# Altium project ElectronicsBox_v3.PrjPcb
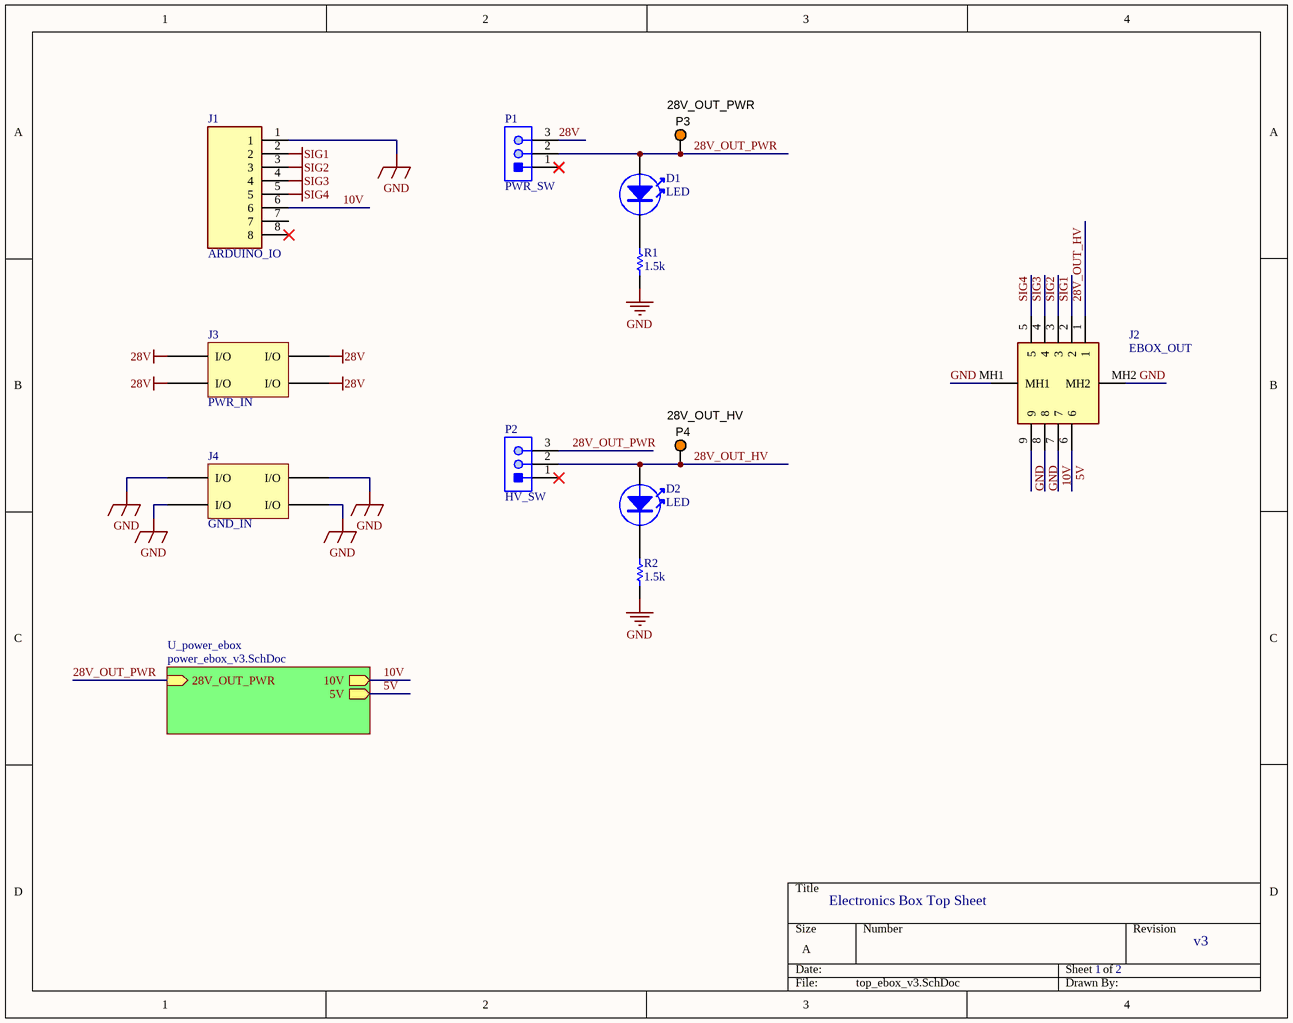
[diagram p0: top_ebox_v3.SchDoc]
2 sheets, 28 parts. Net scope: hierarchical (ports join the sheet entries above them; power ports are global).
Board file: ebox_board_v3.PcbDoc
Sheets:
  top_ebox_v3.SchDoc
    U_power_ebox = power_ebox_v3.SchDoc

## Sheet top_ebox_v3.SchDoc
size A; SheetNumber: 1; SheetTotal: 2

### Parts
D1  LED  [LED 12V Thru Hole]
D2  LED  [LED 12V Thru Hole]
J1  ARDUINO_IO  [1x8 Molex Header - Female]
J2  EBOX_OUT  [9-Pin D-Sub]
J3  PWR_IN  [Banana Jack]
J4  GND_IN  [Banana Jack]
P1  PWR_SW  [3x1 KK Molex]
P2  HV_SW  [3x1 KK Molex]
P3  28V_OUT_PWR  [KSTN-5003]
P4  28V_OUT_HV  [KSTN-5003]
R1  1.5k  [General Resistor]
R2  1.5k  [General Resistor]

### Sub-sheets
U_power_ebox = power_ebox_v3.SchDoc: 10V (out), 5V (out), 28V_OUT_PWR (in)

### Nets
28V: J3.1(I/O) J3.2(I/O) J3.3(I/O) J3.4(I/O) P1.3
GND: J1.1 J2.8 J2.9 J2.MH1 J2.MH2 J4.1(I/O) J4.2(I/O) J4.3(I/O) J4.4(I/O) R1.2 R2.2
SIG1: J1.2 J2.2
SIG2: J1.3 J2.3
SIG3: J1.4 J2.4
SIG4: J1.5 J2.5
5V: J2.6 ; sheet U_power_ebox/5V
10V: J1.6 J2.7 ; sheet U_power_ebox/10V
28V_OUT_HV: D2.1 J2.1 P2.2 P4.1
28V_OUT_PWR: D1.1 P1.2 P2.3 P3.1 ; sheet U_power_ebox/28V_OUT_PWR
NetD1_2: D1.2 R1.1
NetD2_2: D2.2 R2.1

Not connected (* = marked no-connect by the designer): J1 7 8*; P1 1*; P2 1*

### Notes on the sheet
- Electronics Box Top Sheet
- 1
- 2
- v3

### Library data of the parts
J1 = 207843-0008: KK Molex 1x8 Header; Datasheet Link: https://www.molex.com/pdm_docs/sd/2078430008_sd.pdf; Height: 6.95mm; Manufacturer_Name: Molex; Manufacturer_Part_Number: 207843-0008; Mouser Part Number: 538-207843-0008; Mouser Price/Stock: https://www.mouser.co.uk/ProductDetail/Molex/207843-0008?qs=XeJtXLiO41QJV3n1oae5pg%3D%3D
J2 = 2311765-1: Connector; Manufacturer_Name: TE Connectivity; Datasheet Link: https://componentsearchengine.com//2311765-1.pdf; Height: 12.8mm; Mouser2 Part Number: 571-2311765-1; Mouser2 Price/Stock: https://www.mouser.com/Search/Refine.aspx?Keyword=571-2311765-1; Manufacturer_Part_Number: 2311765-1
J3 J4 = Banana Jack: Female
P1 P2 = KK 254 1x3 male header: 22112032
P3 P4 = CMP-002-00037-2: Test Point, Orange, Height 4.6 mm, Tail Length 3 mm, 1-Pin THD, RoHS; Manufacturer: Keystone; Colour: Orange; Packaging: Bulk; Package Description: 1-Pin Through Hole Device, Dia 2.54 mm; Pins: 1; Package Reference: 5003; Datasheet Version: Jun-15; Case/Package: 5003; Mounting Technology: TH; Connector Type: TestPoint; Diameter: 2.54mm; Contact Material: Bronze; Datasheet URL: http://keyelco.com/userAssets/file/M65p56.pdf; Manufacturer URL: http://www.keyelco.com/; Package Quantity: 10; Contact Plating: Tin; RoHS Compliant: True
R1 R2 = Resistor

## Sheet power_ebox_v3.SchDoc
size A; SheetNumber: 2; SheetTotal: 2
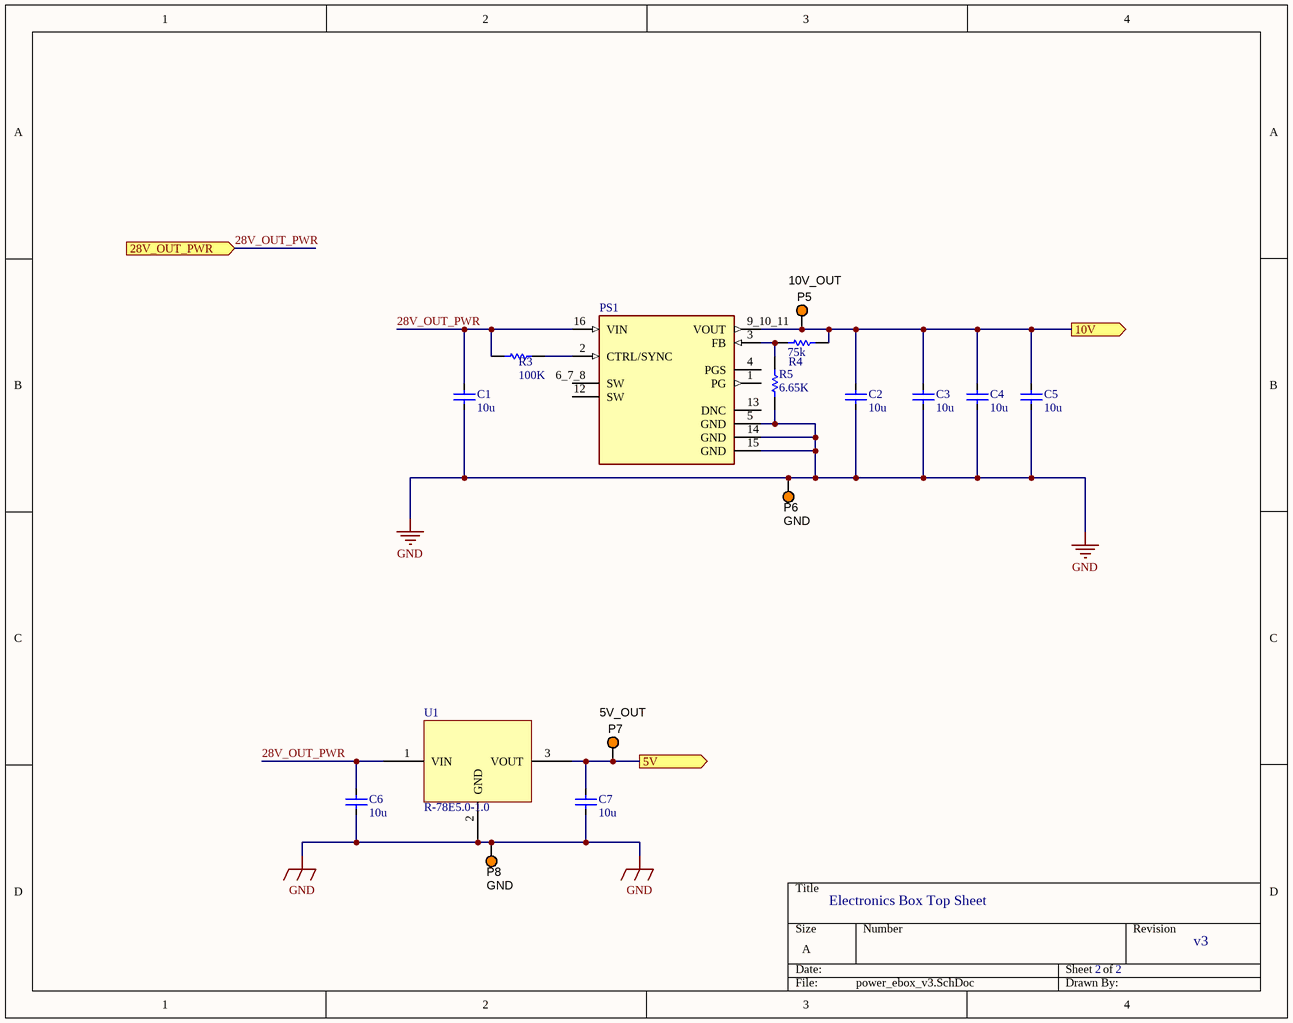
[diagram p1: power_ebox_v3.SchDoc]

### Parts
C1  10u  [10uF Cer SMD]
C2  10u  [10uF Cer SMD]
C3  10u  [10uF Cer SMD]
C4  10u  [10uF Cer SMD]
C5  10u  [10uF Cer SMD]
C6  10u  [10uF Cer SMD]
C7  10u  [10uF Cer SMD]
P5  10V_OUT  [KSTN-5003]
P6  GND  [KSTN-5003]
P7  5V_OUT  [KSTN-5003]
P8  GND  [KSTN-5003]
PS1  *  [10V Step-Down]  (value not drawn)
R3  100K  [General Resistor]
R4  75k  [75K]
R5  6.65K  [6.65K]
U1  R-78E5.0-1.0  [Step-Down Converter]

### Ports
5V (out), 10V (out), 28V_OUT_PWR (in)

### Nets
GND: C1.2 C2.1 C3.1 C4.1 C5.1 C6.1 C7.1 P6.1 P8.1 PS1.5(GND) PS1.14(GND) PS1.15(GND) R5.2 U1.2(GND)
5V: C7.2 P7.1 U1.3(VOUT) ; port 5V
10V: C2.2 C3.2 C4.2 C5.2 P5.1 PS1.9_10_11(VOUT) R4.2 ; port 10V
28V_OUT_PWR: C1.1 C6.2 PS1.16(VIN) R3.2 U1.1(VIN) ; port 28V_OUT_PWR
NetPS1_2: PS1.2(CTRL/SYNC) R3.1
NetPS1_3: PS1.3(FB) R4.1 R5.1

Not connected (* = marked no-connect by the designer): PS1 1(PG) 4(PGS) 6_7_8(SW) 12(SW) 13(DNC)

### Notes on the sheet
- Electronics Box Top Sheet
- 2
- v3

### Library data of the parts
C1-C7 = Capacitor - Ceramic
P5-P8 = CMP-002-00037-2: as P3 on sheet top_ebox_v3; Colour: Orange; Packaging: Bulk; Package Description: 1-Pin Through Hole Device, Dia 2.54 mm; Pins: 1; Package Reference: 5003; Datasheet Version: Jun-15; Case/Package: 5003; Mounting Technology: TH; Connector Type: TestPoint; Diameter: 2.54mm; Contact Material: Bronze; Datasheet URL: http://keyelco.com/userAssets/file/M65p56.pdf; Manufacturer URL: http://www.keyelco.com/; Package Quantity: 10; Contact Plating: Tin; RoHS Compliant: True
PS1 = 10V Step-Down: Non-Isolated DC/DC Converters 4-36Vin 0.8-24Vout 1.5A; MP: RPX-1.5-R; MF: Recom Power; Value: *; Availability: Warning; Package: None; Check_prices: https://www.snapeda.com/parts/RPX-1.5-R/Recom%20Power/view-part/5138341/?ref=eda; Price: None; SnapEDA_Link: https://www.snapeda.com/parts/RPX-1.5-R/Recom%20Power/view-part/5138341/?ref=snap; Purchase-URL: https://pricing.snapeda.com/search/part/RPX-1.5-R/?ref=eda
R3-R5 = Resistor
U1 = Step-down Converter

## Nets that join several sheets
GND: top_ebox_v3 (11 pins), power_ebox_v3 (14 pins)
5V: top_ebox_v3 (J2.6), power_ebox_v3 (C7.2 P7.1 U1.3)
10V: top_ebox_v3 (J1.6 J2.7), power_ebox_v3 (7 pins)
28V_OUT_PWR: top_ebox_v3 (D1.1 P1.2 P2.3 P3.1), power_ebox_v3 (5 pins)